# EAGLE schematic HDMI-Display_v10-0603 (EAGLE 7.2.0)

## Sheet 1 of 2
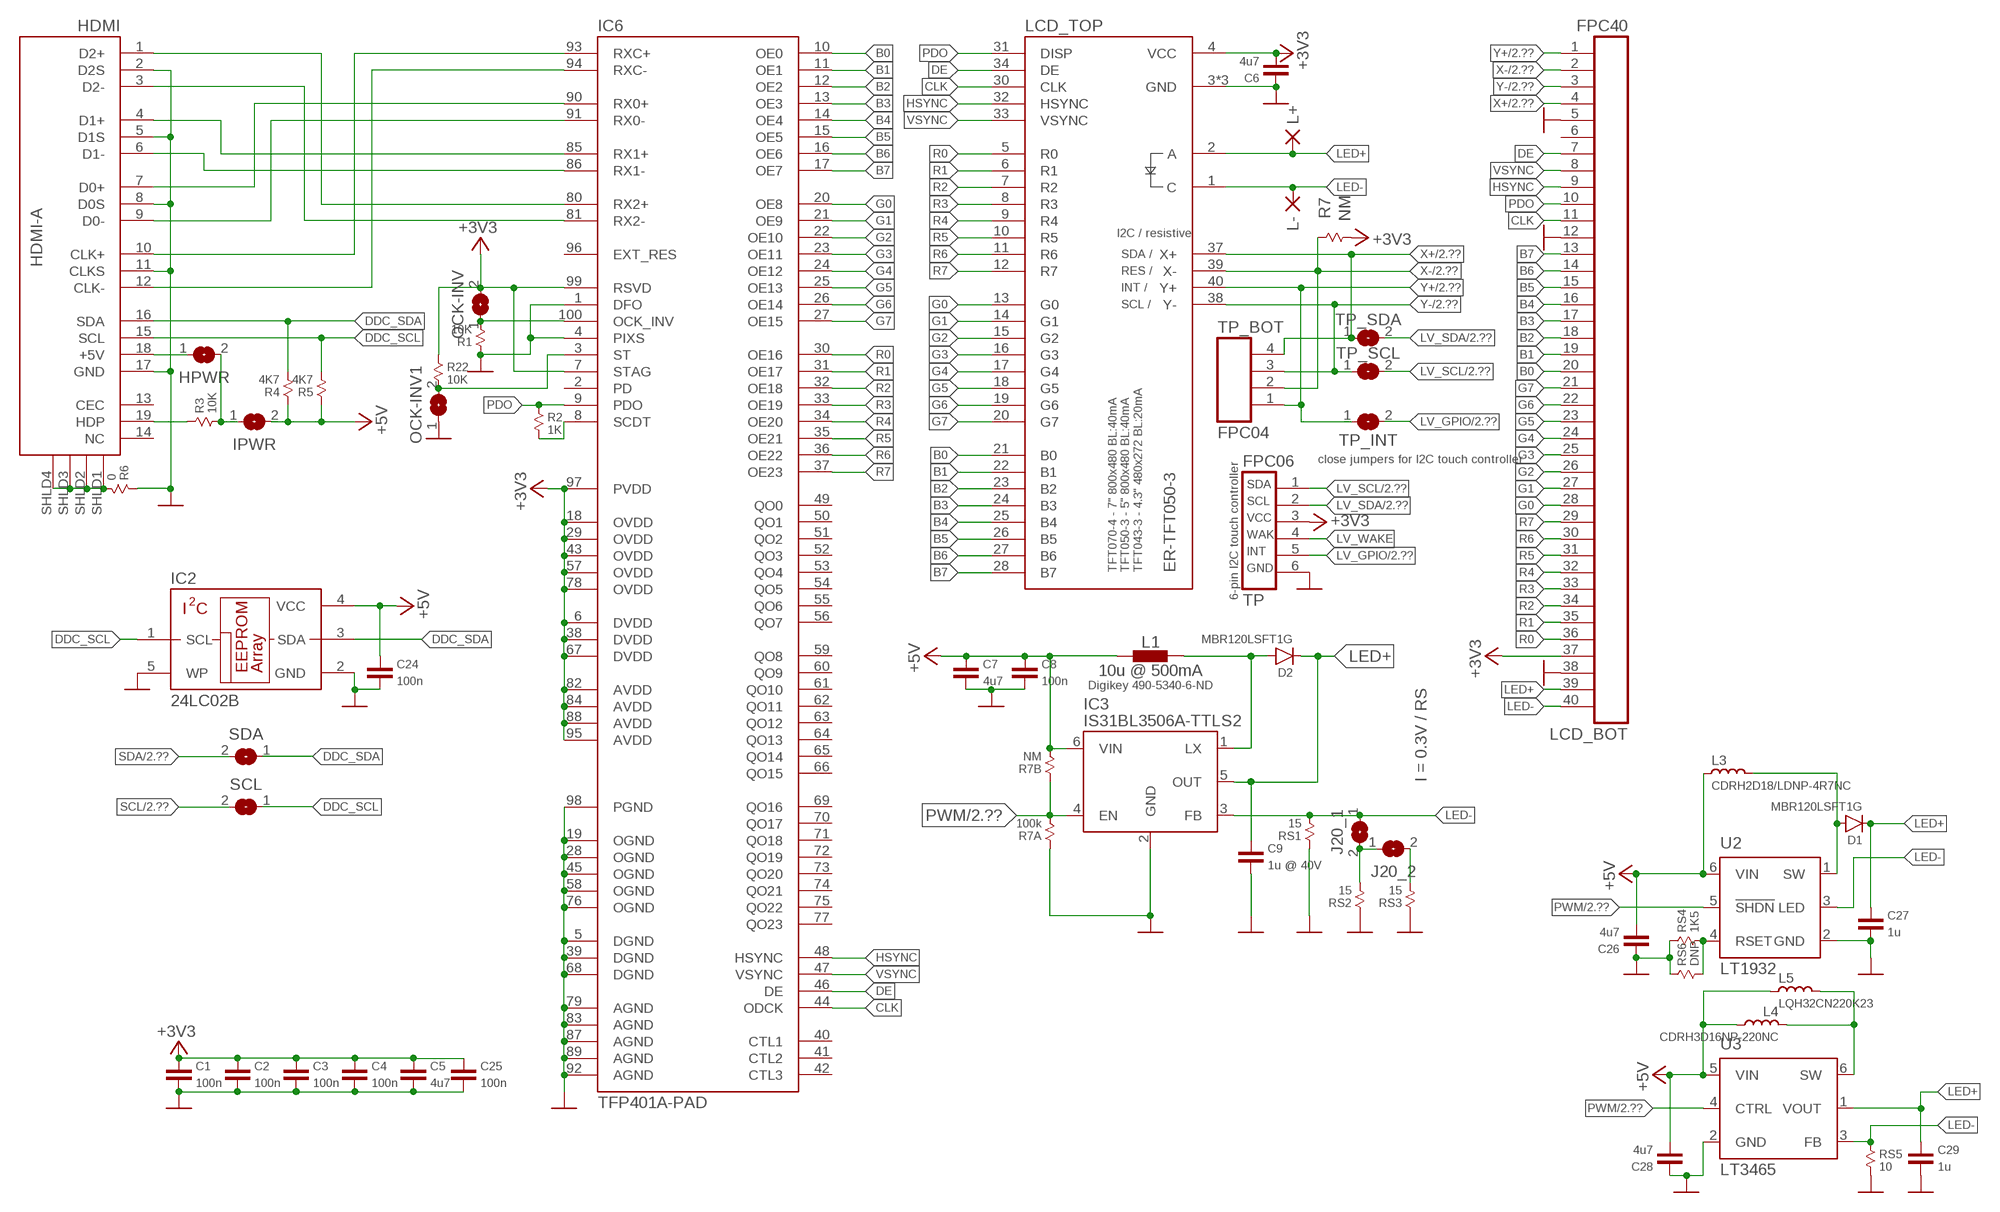
[diagram p0: schematic, sheet 1]

### Parts
C1  100n  CAP-0603  [0603]
C2  100n  CAP-0603  [0603]
C3  100n  CAP-0603  [0603]
C4  100n  CAP-0603  [0603]
C5  4u7  CAP-0603  [0603]
C6  4u7  CAP-0603  [0603]
C7  4u7  CAP-0603  [0603]
C8  100n  CAP-0603  [0603]
C9  1u @ 40V  CAP-0805  [0805]
C24  100n  CAP-0603  [0603]
C25  100n  CAP-0603  [0603]
C26  4u7  CAP-0603  [0603]
C27  1u  CAP-0603  [0603]
C28  4u7  CAP-0603  [0603]
C29  1u  CAP-0603  [0603]
D1  MBR120LSFT1G  DIODE-SOD-123  [SOD-123]
D2  MBR120LSFT1G  DIODE-SOD-123  [SOD-123]
HDMI  HDMI-A  [HDMI_10029449]
HPWR  JUMPER2-0603  [JUMPER2-0603]
IC2  24LC02B  24LC-I/OT  [SOT23-5]
IC3  IS31BL3506A-TTLS2  [SOT23-6]
IC6  TFP401A-PAD  [TQFP100-PAD]
IPWR  JUMPER2-0603  [JUMPER2-0603]
J20_1  JUMPER2-0402  [JUMPER2-0402]
J20_2  JUMPER2-0402  [JUMPER2-0402]
L1  10u @ 500mA  INDUCTOR-1212  [L_1212]
L3  CDRH2D18/LDNP-4R7NC  INDUCTOR-CDRH2D18  [CDRH2D18]
L4  CDRH3D16NP-220NC  INDUCTOR-CDRH3D16  [CDRH3D16]
L5  LQH32CN220K23  INDUCTOR-LQH32CN  [LQH32CN_23/LQH32CN_33]
L+  PAD-0.80X1.60_NC  [PAD-0.80X1.60_NC]
L-  PAD-0.80X1.60_NC  [PAD-0.80X1.60_NC]
LCD_BOT  FPC40  [FPC40]
LCD_TOP  ER-TFT050-3  [FPC40]
OCK-INV  JUMPER2-0603-NC  [JUMPER2-0603_NC]
OCK-INV1  JUMPER2-0603-NC  [JUMPER2-0603_NC]
R1  10K  RESISTOR-0603  [0603]
R2  1K  RESISTOR-0603  [0603]
R3  10K  RESISTOR-0603  [0603]
R4  4K7  RESISTOR-0603  [0603]
R5  4K7  RESISTOR-0603  [0603]
R6  0  RESISTOR-0603  [0603]
R7  NM  RESISTOR-0603  [0603]
R7A  100k  RESISTOR-0603  [0603]
R7B  NM  RESISTOR-0603  [0603]
R22  10K  RESISTOR-0603  [0603]
RS1  15  RESISTOR-0603  [0603]
RS2  15  RESISTOR-0603  [0603]
RS3  15  RESISTOR-0603  [0603]
RS4  1K5  RESISTOR-0603  [0603]
RS5  10  RESISTOR-0603  [0603]
RS6  DNP  RESISTOR-0603  [0603]
SCL  JUMPER2-0603  [JUMPER2-0603]
SDA  JUMPER2-0603  [JUMPER2-0603]
TP  FPC06  [FPC06]
TP_BOT  FPC04  [FPC04]
TP_INT  JUMPER2-0402  [JUMPER2-0402]
TP_SCL  JUMPER2-0402  [JUMPER2-0402]
TP_SDA  JUMPER2-0402  [JUMPER2-0402]
U2  LT1932  [SOT23-6]
U3  LT3465  [SOT23-6]

### Nets
+3V3: C1.2 C2.2 C3.2 C4.2 C5.2 C6.1 C25.2 IC6.6(DVDD) IC6.7(STAG) IC6.18(OVDD) IC6.29(OVDD) IC6.38(DVDD) IC6.43(OVDD) IC6.57(OVDD) IC6.67(DVDD) IC6.78(OVDD) IC6.82(AVDD) IC6.84(AVDD) IC6.88(AVDD) IC6.95(AVDD) IC6.97(PVDD) IC6.99(RSVD) LCD_BOT.37 LCD_TOP.4(VCC) OCK-INV.2 R7.2 R22.1 TP.3 ; also sheet 2
+5V: C7.2 C8.2 C24.2 C26.1 C28.1 IC2.4(VCC) IC3.6(VIN) IPWR.2 L1.1 L3.1 L4.2 L5.1 R4.1 R5.1 R7B.2 U2.6(VIN) U3.5(VIN) ; also sheet 2
B0: IC6.10(OE0) LCD_BOT.20 LCD_TOP.21(B0)
B1: IC6.11(OE1) LCD_BOT.19 LCD_TOP.22(B1)
B2: IC6.12(OE2) LCD_BOT.18 LCD_TOP.23(B2)
B3: IC6.13(OE3) LCD_BOT.17 LCD_TOP.24(B3)
B4: IC6.14(OE4) LCD_BOT.16 LCD_TOP.25(B4)
B5: IC6.15(OE5) LCD_BOT.15 LCD_TOP.26(B5)
B6: IC6.16(OE6) LCD_BOT.14 LCD_TOP.27(B6)
B7: IC6.17(OE7) LCD_BOT.13 LCD_TOP.28(B7)
CLK: IC6.44(ODCK) LCD_BOT.11 LCD_TOP.30(CLK)
CLK_N: HDMI.12(CLK-) IC6.94(RXC-)
CLK_P: HDMI.10(CLK+) IC6.93(RXC+)
D0_N: HDMI.9(D0-) IC6.91(RX0-)
D0_P: HDMI.7(D0+) IC6.90(RX0+)
D1_N: HDMI.6(D1-) IC6.86(RX1-)
D1_P: HDMI.4(D1+) IC6.85(RX1+)
D2_N: HDMI.3(D2-) IC6.81(RX2-)
D2_P: HDMI.1(D2+) IC6.80(RX2+)
DDC_SCL: HDMI.15(SCL) IC2.1(SCL) R5.2 SCL.1
DDC_SDA: HDMI.16(SDA) IC2.3(SDA) R4.2 SDA.1
DE: IC6.46(DE) LCD_BOT.7 LCD_TOP.34(DE)
G0: IC6.20(OE8) LCD_BOT.28 LCD_TOP.13(G0)
G1: IC6.21(OE9) LCD_BOT.27 LCD_TOP.14(G1)
G2: IC6.22(OE10) LCD_BOT.26 LCD_TOP.15(G2)
G3: IC6.23(OE11) LCD_BOT.25 LCD_TOP.16(G3)
G4: IC6.24(OE12) LCD_BOT.24 LCD_TOP.17(G4)
G5: IC6.25(OE13) LCD_BOT.23 LCD_TOP.18(G5)
G6: IC6.26(OE14) LCD_BOT.22 LCD_TOP.19(G6)
G7: IC6.27(OE15) LCD_BOT.21 LCD_TOP.20(G7)
GND: C1.1 C2.1 C3.1 C4.1 C5.1 C6.2 C7.1 C8.1 C9.1 C24.1 C25.1 C26.2 C27.1 C28.2 C29.1 HDMI.2(D2S) HDMI.5(D1S) HDMI.8(D0S) HDMI.11(CLKS) HDMI.17(GND) IC2.2(GND) IC2.5(WP) IC3.2(GND) IC6.1(DFO) IC6.4(PIXS) IC6.5(DGND) IC6.19(OGND) IC6.28(OGND) IC6.39(DGND) IC6.45(OGND) IC6.58(OGND) IC6.68(DGND) IC6.76(OGND) IC6.79(AGND) IC6.83(AGND) IC6.87(AGND) IC6.89(AGND) IC6.92(AGND) IC6.98(PGND) LCD_BOT.5 LCD_BOT.12 LCD_BOT.38 LCD_TOP.3(GND) LCD_TOP.29(GND) LCD_TOP.36(GND) OCK-INV1.1 R1.1 R6.1 R7A.1 RS1.1 RS2.1 RS3.1 RS4.1 RS5.2 RS6.1 TP.6 U2.2(GND) U3.2(GND) ; also sheet 2
HDMI_5V: HDMI.18(+5V) HPWR.1
HDMI_DECT: HDMI.19(HDP) R3.1
HSYNC: IC6.48(HSYNC) LCD_BOT.9 LCD_TOP.32(HSYNC)
LED+: C9.2 C27.2 C29.2 D1.C D2.C IC3.5(OUT) L+.1(P) LCD_BOT.39 LCD_TOP.2(A) U3.1(VOUT)
LED-: IC3.3(FB) J20_1.1 L-.1(P) LCD_BOT.40 LCD_TOP.1(C) RS1.2 RS5.1 U2.3(LED) U3.3(FB)
LV_GPIO: TP.5 TP_INT.2 ; also sheet 2
LV_SCL: TP.1 TP_SCL.2 ; also sheet 2
LV_SDA: TP.2 TP_SDA.2 ; also sheet 2
LV_WAKE: TP.4
LX: D2.A IC3.1(LX) L1.2
N$1: J20_2.2 RS3.2
N$4: J20_1.2 J20_2.1 RS2.2
N$6: IC6.100(OCK_INV) OCK-INV.1 R1.2
N$7: IC6.3(ST) OCK-INV1.2 R22.2
N$9: HPWR.2 IPWR.1 R3.2
N$10: RS4.2 RS6.2 U2.4(RSET)
N$14: D1.A L3.2 U2.1(SW)
N$16: L4.1 L5.2 U3.6(SW)
PDO: IC6.9(PDO) LCD_BOT.10 LCD_TOP.31(DISP) R2.1
PWM: IC3.4(EN) R7A.2 R7B.1 U2.5(!SHDN) U3.4(CTRL) ; also sheet 2
R0: IC6.30(OE16) LCD_BOT.36 LCD_TOP.5(R0)
R1: IC6.31(OE17) LCD_BOT.35 LCD_TOP.6(R1)
R2: IC6.32(OE18) LCD_BOT.34 LCD_TOP.7(R2)
R3: IC6.33(OE19) LCD_BOT.33 LCD_TOP.8(R3)
R4: IC6.34(OE20) LCD_BOT.32 LCD_TOP.9(R4)
R5: IC6.35(OE21) LCD_BOT.31 LCD_TOP.10(R5)
R6: IC6.36(OE22) LCD_BOT.30 LCD_TOP.11(R6)
R7: IC6.37(OE23) LCD_BOT.29 LCD_TOP.12(R7)
SCDT: IC6.8(SCDT) R2.2
SCL: SCL.2 ; also sheet 2
SDA: SDA.2 ; also sheet 2
SHLD3: HDMI.SHLD1(SHLD) HDMI.SHLD2(SHLD) HDMI.SHLD3(SHLD) HDMI.SHLD4(SHLD) R6.2
VSYNC: IC6.47(VSYNC) LCD_BOT.8 LCD_TOP.33(VSYNC)
X+: LCD_BOT.4 LCD_TOP.37(X+) TP_BOT.4 TP_SDA.1 ; also sheet 2
X-: LCD_BOT.2 LCD_TOP.39(X-) R7.1 TP_BOT.2 ; also sheet 2
Y+: LCD_BOT.1 LCD_TOP.40(Y+) TP_BOT.1 TP_INT.1 ; also sheet 2
Y-: LCD_BOT.3 LCD_TOP.38(Y-) TP_BOT.3 TP_SCL.1 ; also sheet 2
Unconnected: HDMI.13(CEC) HDMI.14(NC) IC6.2(PD) IC6.40(CTL1) IC6.41(CTL2) IC6.42(CTL3) IC6.49(QO0) IC6.50(QO1) IC6.51(QO2) IC6.52(QO3) IC6.53(QO4) IC6.54(QO5) IC6.55(QO6) IC6.56(QO7) IC6.59(QO8) IC6.60(QO9) IC6.61(QO10) IC6.62(QO11) IC6.63(QO12) IC6.64(QO13) IC6.65(QO14) IC6.66(QO15) IC6.69(QO16) IC6.70(QO17) IC6.71(QO18) IC6.72(QO19) IC6.73(QO20) IC6.74(QO21) IC6.75(QO22) IC6.77(QO23) IC6.96(EXT_RES) LCD_BOT.6

### Notes on the sheet
- I2C / resistive
- SDA /
- RES /
- INT /
- SCL /
- close jumpers for I2C touch controller
- SDA
- SCL
- VCC
- 6-pin I2C touch controller
- WAK
- INT
- TFT070-4 - 7" 800x480 BL:40mA
  TFT050-3 - 5" 800x480 BL:40mA
  TFT043-3 - 4.3" 480x272 BL:20mA
- GND
- Digikey 490-5340-6-ND
- I = 0.3V / RS

## Sheet 2 of 2
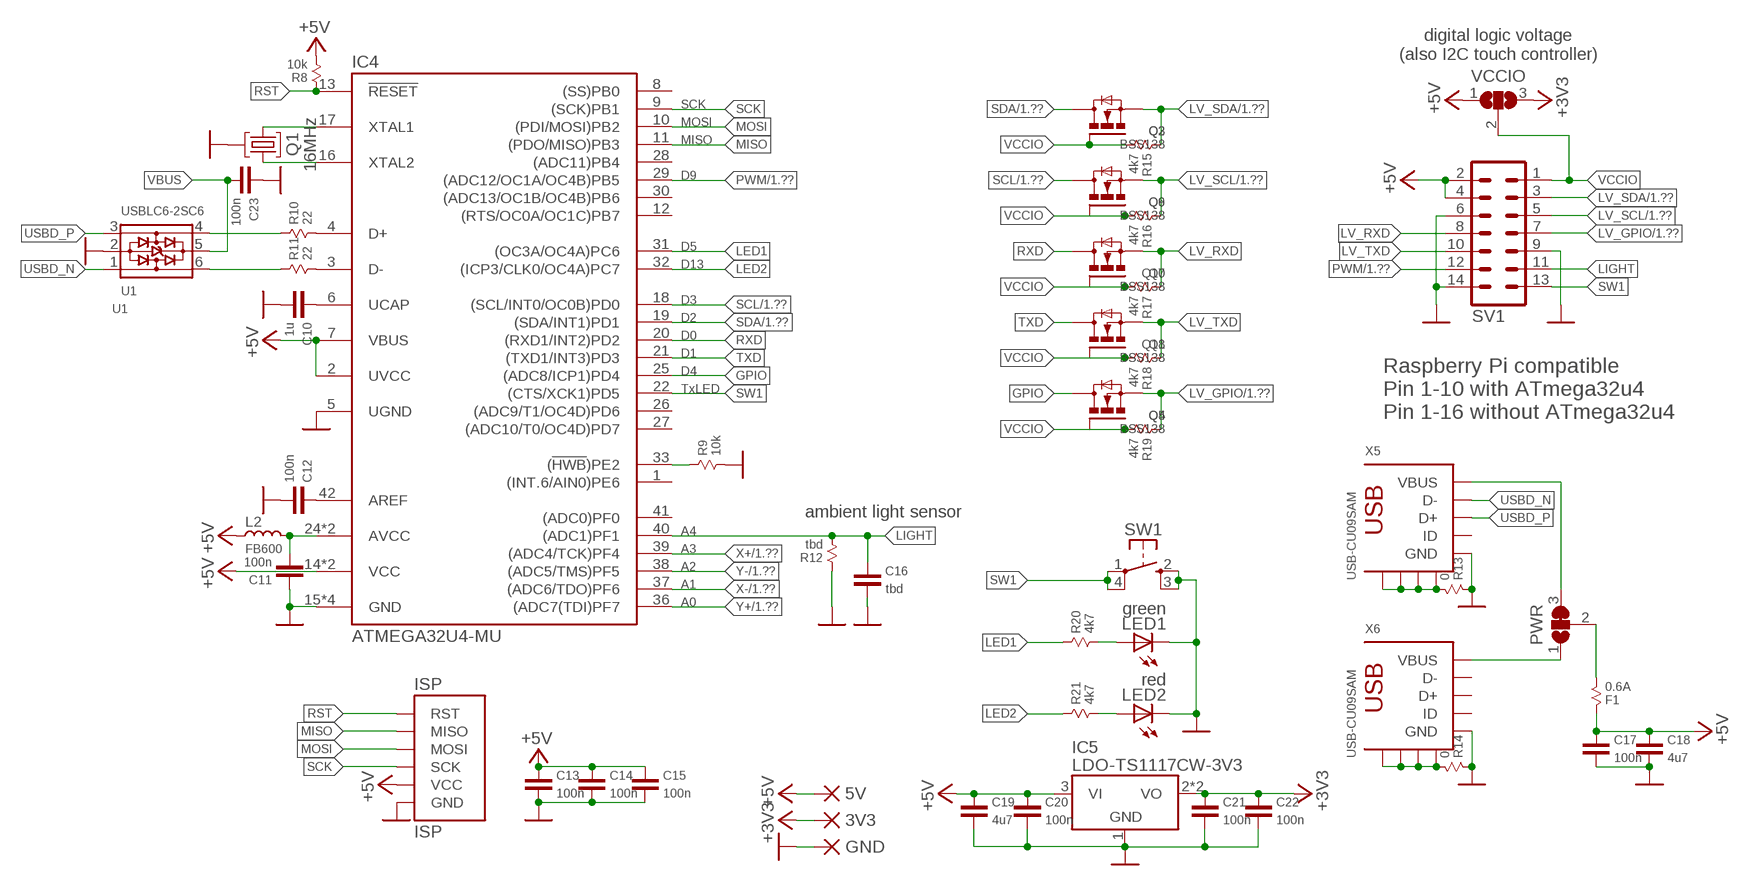
[diagram p1: schematic, sheet 2]

### Parts
3V3  PAD-1.27X1.27_NC  [PAD-1.27X1.27_NC]
5V  PAD-1.27X1.27_NC  [PAD-1.27X1.27_NC]
C10  1u  CAP-0603  [0603]
C11  100n  CAP-0603  [0603]
C12  100n  CAP-0603  [0603]
C13  100n  CAP-0603  [0603]
C14  100n  CAP-0603  [0603]
C15  100n  CAP-0603  [0603]
C16  tbd  CAP-0603  [0603]
C17  100n  CAP-0603  [0603]
C18  4u7  CAP-0603  [0603]
C19  4u7  CAP-0603  [0603]
C20  100n  CAP-0603  [0603]
C21  100n  CAP-0603  [0603]
C22  100n  CAP-0603  [0603]
C23  100n  CAP-0603  [0603]
F1  0.6A  RESISTOR-0805  [0805]
GND  PAD-1.27X1.27_NC  [PAD-1.27X1.27_NC]
IC4  ATMEGA32U4-MU  [QFN44]
IC5  LDO-TS1117CW-3V3  [SOT223]
ISP  ISP  [ISP]
L2  FB600  INDUCTOR-0603  [0603]
LED1  green  LED-0603  [LED_0603]
LED2  red  LED-0603  [LED_0603]
PWR  JUMPER3-0603  [JUMPER3-0603]
Q1  16MHz  CRYSTAL-RES-32  [CRYSTAL_32X13]
Q2  MOSFET-N-SOT323  [SOT323]
Q3  BSS138  MOSFET-N-SOT23  [SOT-23]
Q4  BSS138  MOSFET-N-SOT23  [SOT-23]
Q5  MOSFET-N-SOT323  [SOT323]
Q6  MOSFET-N-SOT323  [SOT323]
Q7  MOSFET-N-SOT323  [SOT323]
Q8  MOSFET-N-SOT323  [SOT323]
Q9  BSS138  MOSFET-N-SOT23  [SOT-23]
Q10  BSS138  MOSFET-N-SOT23  [SOT-23]
Q11  BSS138  MOSFET-N-SOT23  [SOT-23]
R8  10k  RESISTOR-0603  [0603]
R9  10k  RESISTOR-0603  [0603]
R10  22  RESISTOR-0603  [0603]
R11  22  RESISTOR-0603  [0603]
R12  tbd  RESISTOR-0603  [0603]
R13  0  RESISTOR-0603  [0603]
R14  0  RESISTOR-0603  [0603]
R15  4k7  RESISTOR-0603  [0603]
R16  4k7  RESISTOR-0603  [0603]
R17  4k7  RESISTOR-0603  [0603]
R18  4k7  RESISTOR-0603  [0603]
R19  4k7  RESISTOR-0603  [0603]
R20  4k7  RESISTOR-0603  [0603]
R21  4k7  RESISTOR-0603  [0603]
SV1  MA07-2  [MA07-2]
SW1  SW-TACTILE-TL3315  [SW_TL3315N]
U1  USBLC6-2SC6  [SOT23-6]
VCCIO  JUMPER3-0603-NC  [JUMPER3-0603_NC]
X5  USB-CU09SAM  [CU09SAM]
X6  USB-CU09SAM  [CU09SAM]

### Nets
+3V3: 3V3.1(P) C21.2 C22.2 IC5.2(VO) IC5.4(VO) VCCIO.3 ; also sheet 1
+5V: 5V.1(P) C13.2 C14.2 C15.2 C17.2 C18.2 C19.2 C20.2 F1.1 IC4.2(UVCC) IC4.7(VBUS) IC4.14(VCC) IC4.34(VCC) IC5.3(VI) ISP.VCC L2.1 R8.2 SV1.2 SV1.4 VCCIO.1 ; also sheet 1
AREF: C12.2 IC4.42(AREF)
AVCC: C11.1 IC4.24(AVCC) IC4.44(AVCC) L2.2
D_N: IC4.3(D-) R11.2
D_P: IC4.4(D+) R10.2
GND: C10.1 C11.2 C12.1 C13.1 C14.1 C15.1 C16.1 C17.1 C18.1 C19.1 C20.1 C21.1 C22.1 C23.2 GND.1(P) IC4.5(UGND) IC4.15(GND) IC4.23(GND) IC4.35(GND) IC4.43(GND) IC5.1(GND) ISP.GND LED1.C LED2.C Q1.GND R9.2 R12.1 R13.1 R14.1 SV1.6 SV1.9 SV1.14 SW1.2(S1) SW1.3(S2) U1.2(GND) X5.5(GND) X6.5(GND) ; also sheet 1
GPIO: IC4.25((ADC8/ICP1)PD4) Q4.3(D) Q5.3(D)
HWB: IC4.33((!HWB!)PE2) R9.1
LED1: IC4.31((OC3A/OC4A)PC6) R20.1
LED2: IC4.32((ICP3/CLK0/OC4A)PC7) R21.1
LIGHT: C16.2 IC4.40((ADC1)PF1) R12.2 SV1.11
LV_GPIO: Q4.2(S) Q5.2(S) R19.1 SV1.7 ; also sheet 1
LV_RXD: Q7.2(S) Q10.2(S) R17.1 SV1.8
LV_SCL: Q6.2(S) Q9.2(S) R16.1 SV1.5 ; also sheet 1
LV_SDA: Q2.2(S) Q3.2(S) R15.1 SV1.3 ; also sheet 1
LV_TXD: Q8.2(S) Q11.2(S) R18.1 SV1.10
MISO: IC4.11((PDO/MISO)PB3) ISP.MISO
MOSI: IC4.10((PDI/MOSI)PB2) ISP.MOSI
N$3: R11.1 U1.6(IO1)
N$5: R10.1 U1.4(IO2)
N$8: C10.2 IC4.6(UCAP)
N$11: F1.2 PWR.2
N$17: LED1.A R20.2
N$18: LED2.A R21.2
PWM: IC4.29((ADC12/OC1A/OC4B)PB5) SV1.12 ; also sheet 1
RST: IC4.13(!RESET) ISP.RST R8.1
RXD: IC4.20((RXD1/INT2)PD2) Q7.3(D) Q10.3(D)
SCK: IC4.9((SCK)PB1) ISP.SCK
SCL: IC4.18((SCL/INT0/OC0B)PD0) Q6.3(D) Q9.3(D) ; also sheet 1
SDA: IC4.19((SDA/INT1)PD1) Q2.3(D) Q3.3(D) ; also sheet 1
SHLD1: R13.2 X5.GND@1(GND) X5.GND@2(GND) X5.GND@3(GND) X5.GND@4(GND)
SHLD2: R14.2 X6.GND@1(GND) X6.GND@2(GND) X6.GND@3(GND) X6.GND@4(GND)
SW1: IC4.22((CTS/XCK1)PD5) SV1.13 SW1.1 SW1.4(P2)
TXD: IC4.21((TXD1/INT3)PD3) Q8.3(D) Q11.3(D)
USBD_N: U1.1(IO1) X5.2(D-)
USBD_P: U1.3(IO2) X5.3(D+)
VBUS: C23.1 PWR.3 U1.5(VBUS) X5.1(VBUS)
VBUS_PWR: PWR.1 X6.1(VBUS)
VCCIO: Q2.1(G) Q3.1(G) Q4.1(G) Q5.1(G) Q6.1(G) Q7.1(G) Q8.1(G) Q9.1(G) Q10.1(G) Q11.1(G) R15.2 R16.2 R17.2 R18.2 R19.2 SV1.1 VCCIO.2
X+: IC4.39((ADC4/TCK)PF4) ; also sheet 1
X-: IC4.37((ADC6/TDO)PF6) ; also sheet 1
XTAL1: IC4.17(XTAL1) Q1.2
XTAL2: IC4.16(XTAL2) Q1.1
Y+: IC4.36((ADC7(TDI)PF7) ; also sheet 1
Y-: IC4.38((ADC5/TMS)PF5) ; also sheet 1
Unconnected: IC4.1((INT.6/AIN0)PE6) IC4.8((SS)PB0) IC4.12((RTS/OC0A/OC1C)PB7) IC4.26((ADC9/T1/OC4D)PD6) IC4.27((ADC10/T0/OC4D)PD7) IC4.28((ADC11)PB4) IC4.30((ADC13/OC1B/OC4B)PB6) IC4.41((ADC0)PF0) X5.4(ID) X6.2(D-) X6.3(D+) X6.4(ID)

### Notes on the sheet
- digital logic voltage
  (also I2C touch controller)
- SCK
- MOSI
- MISO
- D9
- D5
- D13
- D3
- D2
- D0
- D1
- Raspberry Pi compatible
  Pin 1-10 with ATmega32u4
  Pin 1-16 without ATmega32u4
- D4
- TxLED
- ambient light sensor
- A4
- A3
- A2
- A1
- A0

## Library data of the parts
3V3 5V GND L+ L- = we-rcl:PAD: Pads
C1-C29 = X893:CAP: Capacitor
D1 D2 = X893:DIODE
F1 R1-R7 R7A R7B R8-R22 RS1-RS6 = X893:RESISTOR
HDMI = we-con:HDMI: HDMI Connectors; DIGIKEY: 609-4614-2-ND
HPWR IPWR J20_1 J20_2 OCK-INV OCK-INV1 SCL SDA TP_INT TP_SCL TP_SDA = we-rcl:JUMPER2: 2 Pin Jumpers
IC2 = we-chip:24LC*: Microchip I2C EEPROM 2 Kbit - 24LC02B - 24LC02BT-I/OTDKR-ND 32 Kbit- 24LC32A - 24LC32AT-I/OTDKR-ND; DIGIKEY: 24LC32AT-I/OTDKR-ND
IC3 = we-power:IS31BL3506A: ISSI IS31BL3506A Boost Converter for LED Backlight Input: 2.7...5V Output: up to 35V 300mV Feedback Voltage; DIGIKEY: 706-1213-6-ND
IC4 = we-chip:ATMEGA32U4: Atmel ATmega16U4/32U4 AVR Microcontroller
IC5 = we-power:LDO: LDOs TS1117 800mA, Vin max 12V TS9011 250mA, Vin max 12V - compatible AP2210 300mA, Vin max 15V TS5204 150mA, Vin max 16V
IC6 = we-chip:TFP401A: TI TFP401A HDMI/DVI Receiver; DIGIKEY: 296-9987-ND
ISP = we-board:ISP: ISP 2x6pol connector
L1 = we-power:INDUCTOR: Power Inductors
L2-L5 = X893:INDUCTOR: http://www.murata.com/products/catalog/pdf/o05e.pdf
LCD_BOT = we-con:FPC40: FPC/ZIF Connector FCI 62684-402100AHLF -> 40 Pins 0.5mm top contact FCI 62684-401100AHLF -> 40 Pins 0.5mm bottom contact; DIGIKEY_BOT: 62684-401100AHLF-ND; DIGIKEY_TOP: 62684-402100AHLF-ND
LCD_TOP = we-opto:ER-TFT: EastRising Displays ER-TFT043-3 - 4.3" 480x272 (LED 15mA @ 25.0V) ER-TFT050-3 - 5.0" 800x480 (LED @ 40mA @ 19.2V) ER-TFT070-4 - 7.0" 800x480 (LED @ 40mA @ 20.4V)
LED1 LED2 = we-opto:LED: LEDs
PWR VCCIO = we-rcl:JUMPER3: 3 Pin Jumpers
Q1 = we-rcl:CRYSTAL-RES: Crystal Resonators
Q2-Q11 = X893:MOSFET-N
SV1 = con-lstb:MA07-2: PIN HEADER; OC_FARNELL: unknown; OC_NEWARK: unknown
SW1 = we-switch:SW-TACTILE: Tactile Switches; DIGIKEY: EG4621TR-ND
TP = we-con:FPC06: FPC/ZIF Connector Molex 5034800600 -> 6 Pins 0.5mm top+bottom contact; DIGIKEY: WM1387DKR-ND
TP_BOT = we-con:FPC04: FPC/ZIF Connector FCI HFW4R-1STE1LF -> 4 Pin 1mm bottom contact FCI HFW4R-2STE1LF -> 4 Pin 1mm top contact; DIGIKEY_BOT: 609-1782-6-ND; DIGIKEY_TOP: 609-1783-6-ND
U1 = X893:USBLC6: USBLC6-2SC6 <https://www.terraelectronica.ru/show_pdf.php?pdf=%2Fds%2Fpdf%2Fu%2Fusblc62sc6.pdf>
U2 = X893:LT1932: http://www.linear.com/product/LT1932
U3 = X893:LT3465: LT3465 <http://cds.linear.com/docs/en/datasheet/3465fa.pdf>
X5 X6 = X893:USB: USB Connectors USB-B-PTH is fully proven SKU : PRT-00139 USB-miniB is fully proven SKU : PRT-00587 USB-A-PCB is untested. USB-A-H is throughly reviewed, but untested. Spark Fun Electronics SKU : PRT-00437 USB-B-SMT is throughly reviewed, but untested. Needs silkscreen touching up. USB-A-S has not been used/tested USB-MB-H has not been used/tested